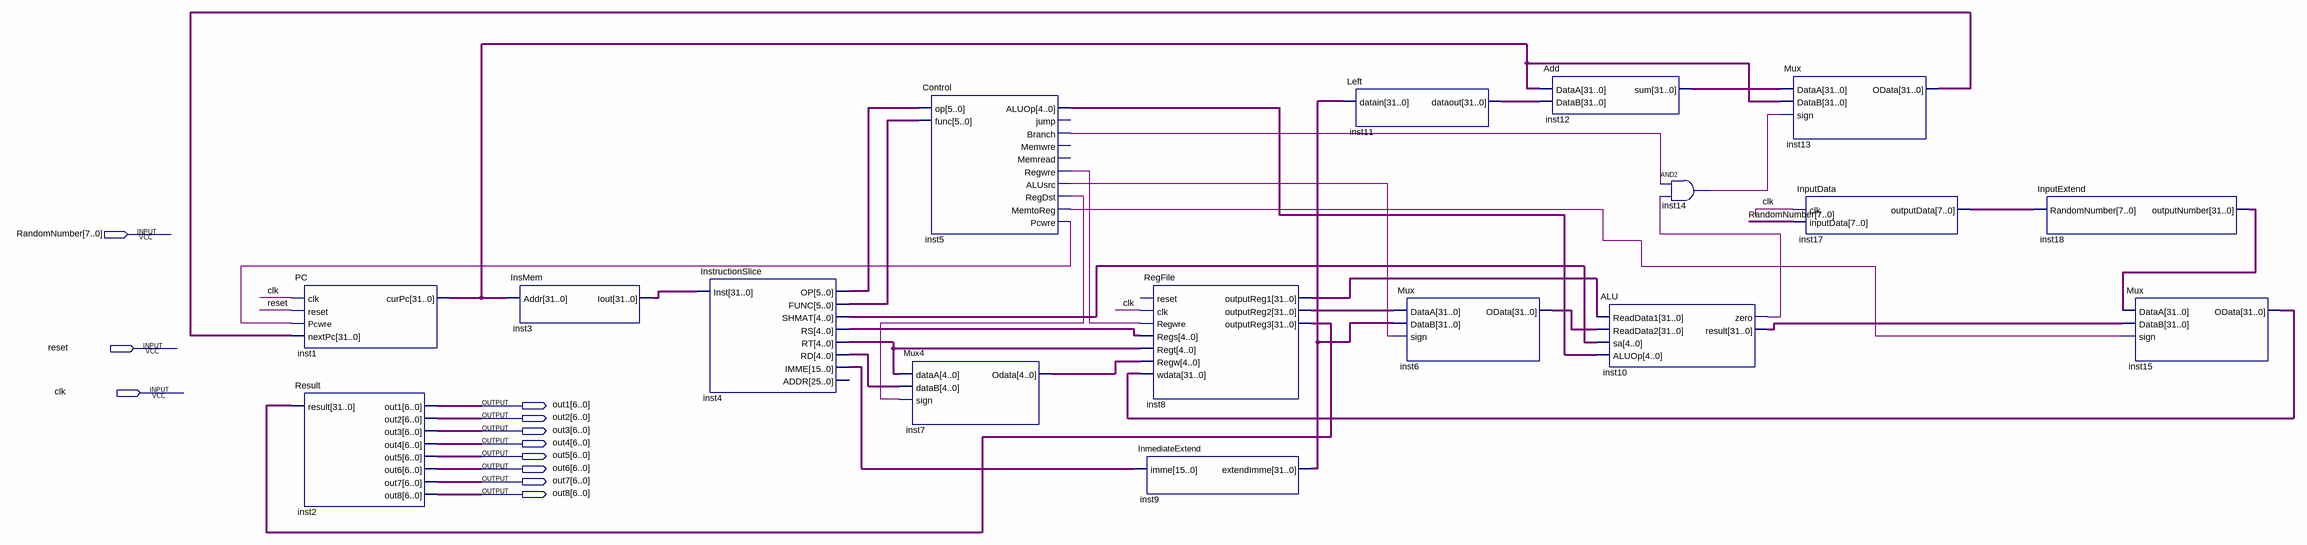
[diagram p0: schematic sheet]
// Quartus schematic CPU.bdf as structural Verilog: 17 symbols, 11 pins
module CPU (
  input  [7:0] RandomNumber,
  input  reset,
  input  clk,
  output [6:0] out1,
  output [6:0] out2,
  output [6:0] out3,
  output [6:0] out4,
  output [6:0] out5,
  output [6:0] out6,
  output [6:0] out7,
  output [6:0] out8
);

  wire inst5_alusrc, inst5_branch, inst5_memtoreg, inst5_pcwre, inst5_regdst, inst5_regwre, inst10_zero,
       inst14_out;
  wire [4:0] inst4_rd, inst4_rs, inst4_rt, inst4_shmat, inst5_aluop, inst7_odata;
  wire [5:0] inst4_func, inst4_op;
  wire [7:0] inst17_outputdata;
  wire [15:0] inst4_imme;
  wire [31:0] inst1_curpc, inst3_iout, inst6_odata, inst8_outputreg1, inst8_outputreg2, inst8_outputreg3,
       inst9_extendimme, inst10_result, inst11_dataout, inst12_sum, inst13_odata, inst15_odata,
       inst18_outputnumber;

  PC inst1 (.clk(clk), .reset(reset), .Pcwre(inst5_pcwre), .nextPc(inst13_odata), .curPc(inst1_curpc));
  Result inst2 (
    .result(inst8_outputreg3), .out1(out1), .out2(out2), .out3(out3), .out4(out4), .out5(out5), .out6(out6),
    .out7(out7), .out8(out8));
  InsMem inst3 (.Addr(inst1_curpc), .Iout(inst3_iout));
  InstructionSlice inst4 (
    .Inst(inst3_iout), .OP(inst4_op), .FUNC(inst4_func), .SHMAT(inst4_shmat), .RS(inst4_rs), .RT(inst4_rt),
    .RD(inst4_rd), .IMME(inst4_imme));  // open: ADDR
  Mux4 inst7 (.dataA(inst4_rt), .dataB(inst4_rd), .sign(inst5_regdst), .Odata(inst7_odata));
  Control inst5 (
    .op(inst4_op), .func(inst4_func), .ALUOp(inst5_aluop), .Branch(inst5_branch), .Regwre(inst5_regwre),
    .ALUsrc(inst5_alusrc), .RegDst(inst5_regdst), .MemtoReg(inst5_memtoreg), .Pcwre(inst5_pcwre));  // open: jump, Memwre, Memread
  RegFile inst8 (
    .clk(clk), .Regwre(inst5_regwre), .Regs(inst4_rs), .Regt(inst4_rt), .Regw(inst7_odata),
    .wdata(inst15_odata), .outputReg1(inst8_outputreg1), .outputReg2(inst8_outputreg2),
    .outputReg3(inst8_outputreg3));  // open: reset
  InmediateExtend inst9 (.imme(inst4_imme), .extendImme(inst9_extendimme));
  Left inst11 (.datain(inst9_extendimme), .dataout(inst11_dataout));
  Mux inst6 (.DataA(inst8_outputreg2), .DataB(inst9_extendimme), .sign(inst5_alusrc), .OData(inst6_odata));
  Add inst12 (.DataA(inst1_curpc), .DataB(inst11_dataout), .sum(inst12_sum));
  ALU inst10 (
    .ReadData1(inst8_outputreg1), .ReadData2(inst6_odata), .sa(inst4_shmat), .ALUOp(inst5_aluop),
    .zero(inst10_zero), .result(inst10_result));
  and inst14 (inst14_out, inst5_branch, inst10_zero);
  Mux inst13 (.DataA(inst12_sum), .DataB(inst1_curpc), .sign(inst14_out), .OData(inst13_odata));
  InputData inst17 (.clk(clk), .inputData(RandomNumber), .outputData(inst17_outputdata));
  InputExtend inst18 (.RandomNumber(inst17_outputdata), .outputNumber(inst18_outputnumber));
  Mux inst15 (.DataA(inst18_outputnumber), .DataB(inst10_result), .sign(inst5_memtoreg), .OData(inst15_odata));
endmodule
